# Altium schematic sheet CAN_SCH.SchDoc: Transceiver CAN
size A4; Author: **; CompanyName: Electrónica Aplicada al Automotor; Organization: UTN FRBA; DocumentNumber: 6; Revision: 00; SheetNumber: 6; SheetTotal: 7; Autor: Badenas, Francisco J. / Ipar, Eugenia
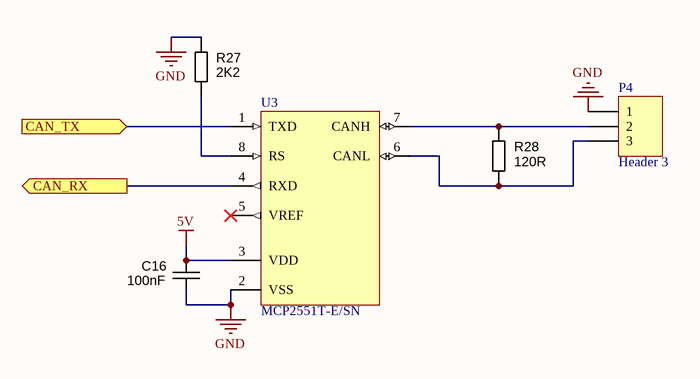
[diagram p0: CAN_SCH.SchDoc]

## Parts
C16  100nF  [CAPC1608X90N]
P4  Header 3  [HDR1X3]
R27  2K2  [RESC1608N_ZERO]
R28  120R  [RESC1608N_ZERO]
U3  MCP2551T-E/SN  [SOIC-SN8_M]

## Ports
CAN_RX (out), CAN_TX (in)

## Nets
5V: C16.1 U3.3(VDD)
GND: C16.2 P4.1 R27.1 U3.2(VSS)
CAN_RX: U3.4(RXD) ; port CAN_RX
CAN_TX: U3.1(TXD) ; port CAN_TX
NetP4_2: P4.2 R28.1 U3.7(CANH)
NetP4_3: P4.3 R28.2 U3.6(CANL)
NetR27_2: R27.2 U3.8(RS)

Not connected (* = marked no-connect by the designer): U3 5(VREF)*

## Notes on the sheet
- Title:
- Size:
- Author:
- A4
- Sheet
- of
- Revision:
- File:
- Date:

## Library data of the parts
C16 = CAPC_47n_0603_X7R_50V_10%: Capacitor SMD Cer 100nF 10% 50V X7R 0603; Manufacturer 1: AVX Corporation; Manufacturer Part Number 1: 06035C473KAT2A; Ratings: 50V; X7R; Material: ceramic; SCDType: spec; Manufacturer 3: Samsung; Manufacturer Part Number 3: CL10B473KBN; Package / Case: 0603 (1608 metric); Tolerance: ±10%; Supplier 1: Digi-Key; Supplier Part Number 1: 478-5146-1-ND; Manufacturer Part Number 2: C1608X7R1H473K080AA; Manufacturer 2: TDK Corporation; ComponentLink1URL: http://www.avx.com/docs/Catalogs/cx7r.pdf; ComponentLink1Description: http://www.avx.com/docs/Catalogs/cx7r.pdf; Supplier 2: Digi-Key; Supplier Part Number 2: 445-1313-1-ND; ComponentLink2URL: http://product.tdk.com/capacitor/mlcc/en/documents/mlcc_commercial_general_en.pdf; ComponentLink2Description: http://product.tdk.com/capacitor/mlcc/en/documents/mlcc_commercial_general_en.pdf; Value: 100nF
P4 = Header 3: Header, 3-Pin; LatestRevisionDate: 17-Jul-2002; LatestRevisionNote: Re-released for DXP Platform.; Publisher: Altium Limited
R27 = RES_0R_0603: Resistor SMD 0603 2.2K 5%; Manufacturer 1: Vishay/Dale; Manufacturer Part Number 1: CRCW06030000Z0EA; Ratings: 1/10W; SCDType: spec; Tolerance: ±5%; Package / Case: 0603 (1608metric); Supplier 1: Digi-Key; Supplier Part Number 1: 541-0.0GCT-ND; ComponentLink1URL: http://www.vishay.com/doc?20035; ComponentLink1Description: http://www.vishay.com/doc?20035; Supplier 2: Digi-Key; Supplier Part Number 2: P0.0GTR-ND; Manufacturer 2: Panasonic Electronic Components; Manufacturer Part Number 2: ERJ-3GEY0R00V; RoHS 2: RoHS Compliant; ComponentLink2URL: http://industrial.panasonic.com/www-cgi/jvcr13pz.cgi?E+PZ+3+AOA0001+ERJ3GEY0R00V+7+WW; ComponentLink2Description: http://industrial.panasonic.com/www-cgi/jvcr13pz.cgi?E+PZ+3+AOA0001+ERJ3GEY0R00V+7+WW; Supplier 3: Digi-Key; Supplier Part Number 3: 311-0.0LECT-ND; Manufacturer 3: Yageo; Manufacturer Part Number 3: AC0603JR-070RL; RoHS 3: RoHS Compliant; ComponentLink3URL: http://www.yageo.com/documents/recent/PYu-AC_51_RoHS_L_2.pdf; ComponentLink3Description: http://www.yageo.com/documents/recent/PYu-AC_51_RoHS_L_2.pdf; Value: 2K2
R28 = RES_0R_0603: Resistor SMD 0603 120 Ohm 5%; Manufacturer 1: Vishay/Dale; Manufacturer Part Number 1: CRCW06030000Z0EA; Ratings: 1/10W; SCDType: spec; Tolerance: ±5%; Package / Case: 0603 (1608metric); Supplier 1: Digi-Key; Supplier Part Number 1: 541-0.0GCT-ND; ComponentLink1URL: http://www.vishay.com/doc?20035; ComponentLink1Description: http://www.vishay.com/doc?20035; Supplier 2: Digi-Key; Supplier Part Number 2: P0.0GTR-ND; Manufacturer 2: Panasonic Electronic Components; Manufacturer Part Number 2: ERJ-3GEY0R00V; RoHS 2: RoHS Compliant; ComponentLink2URL: http://industrial.panasonic.com/www-cgi/jvcr13pz.cgi?E+PZ+3+AOA0001+ERJ3GEY0R00V+7+WW; ComponentLink2Description: http://industrial.panasonic.com/www-cgi/jvcr13pz.cgi?E+PZ+3+AOA0001+ERJ3GEY0R00V+7+WW; Supplier 3: Digi-Key; Supplier Part Number 3: 311-0.0LECT-ND; Manufacturer 3: Yageo; Manufacturer Part Number 3: AC0603JR-070RL; RoHS 3: RoHS Compliant; ComponentLink3URL: http://www.yageo.com/documents/recent/PYu-AC_51_RoHS_L_2.pdf; ComponentLink3Description: http://www.yageo.com/documents/recent/PYu-AC_51_RoHS_L_2.pdf; Value: 120R
U3 = CMP-0186-00036-2: High-Speed CAN Transceiver, 8-Pin SOIC, Extended Temperature, Tape and Reel; PackageReference: SOIC-SN8; PackageDescription: 8-Lead Plastic Small Outline (SN) - Narrow, 3.90mm Body [SOIC]; RevisionNote: URLs added. DatasheetVersion updated.; ComponentLink2Description: Datasheet; ComponentLink1Description: Manufacturer URL; ComponentLink3Description: Package Specification; PackageVersion: revBB, Aug-2009; DatasheetVersion: revF, Jul-2010; Code_JEDEC: MS-012; ComponentLink1URL: http://www.microchip.com/; Code_IPC: SOIC127P600-8; ComponentLink2URL: http://ww1.microchip.com/downloads/en/DeviceDoc/21667F.pdf; ComponentLink3URL: http://www.microchip.com/stellent/groups/techpub_sg/documents/packagingspec/en012702.pdf